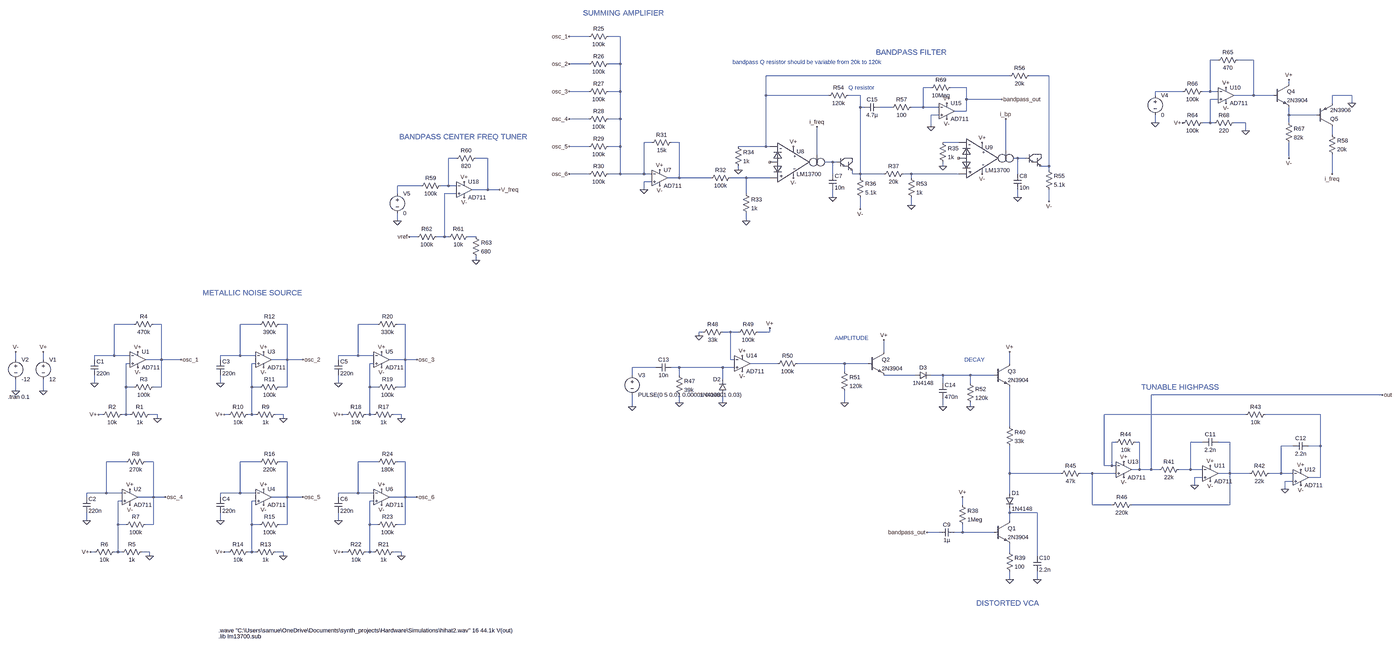
[diagram p0: schematic hihat.asc, whole sheet]
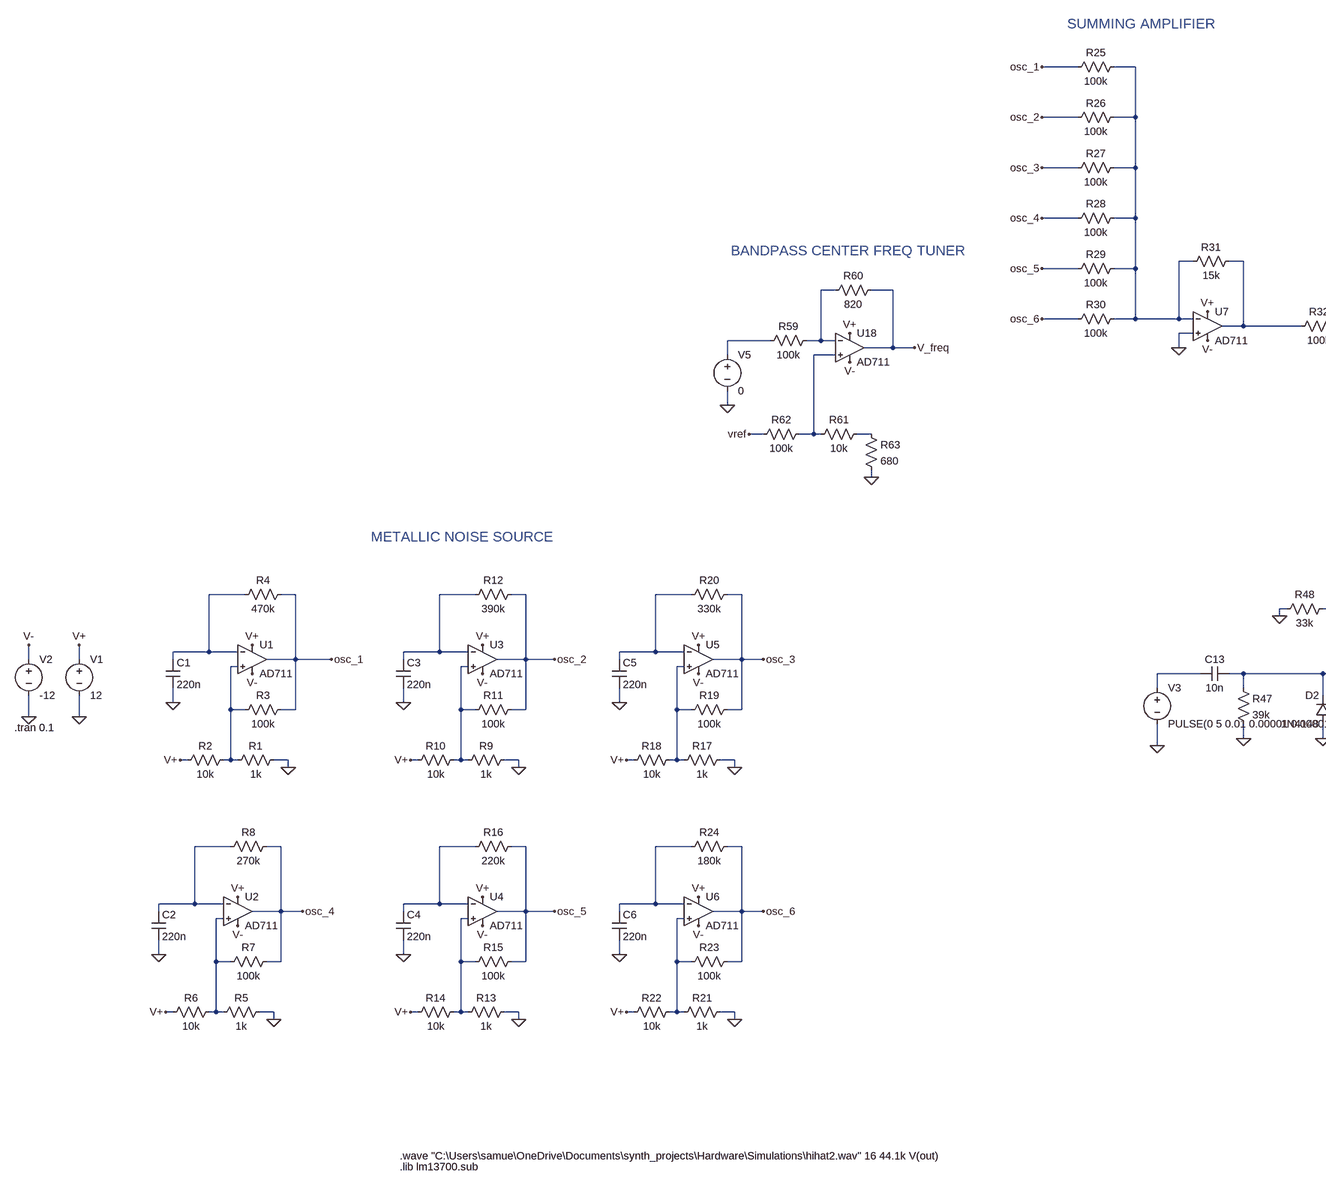
[diagram p1: schematic hihat.asc, part, row 1 of 1, column 1 of 2]
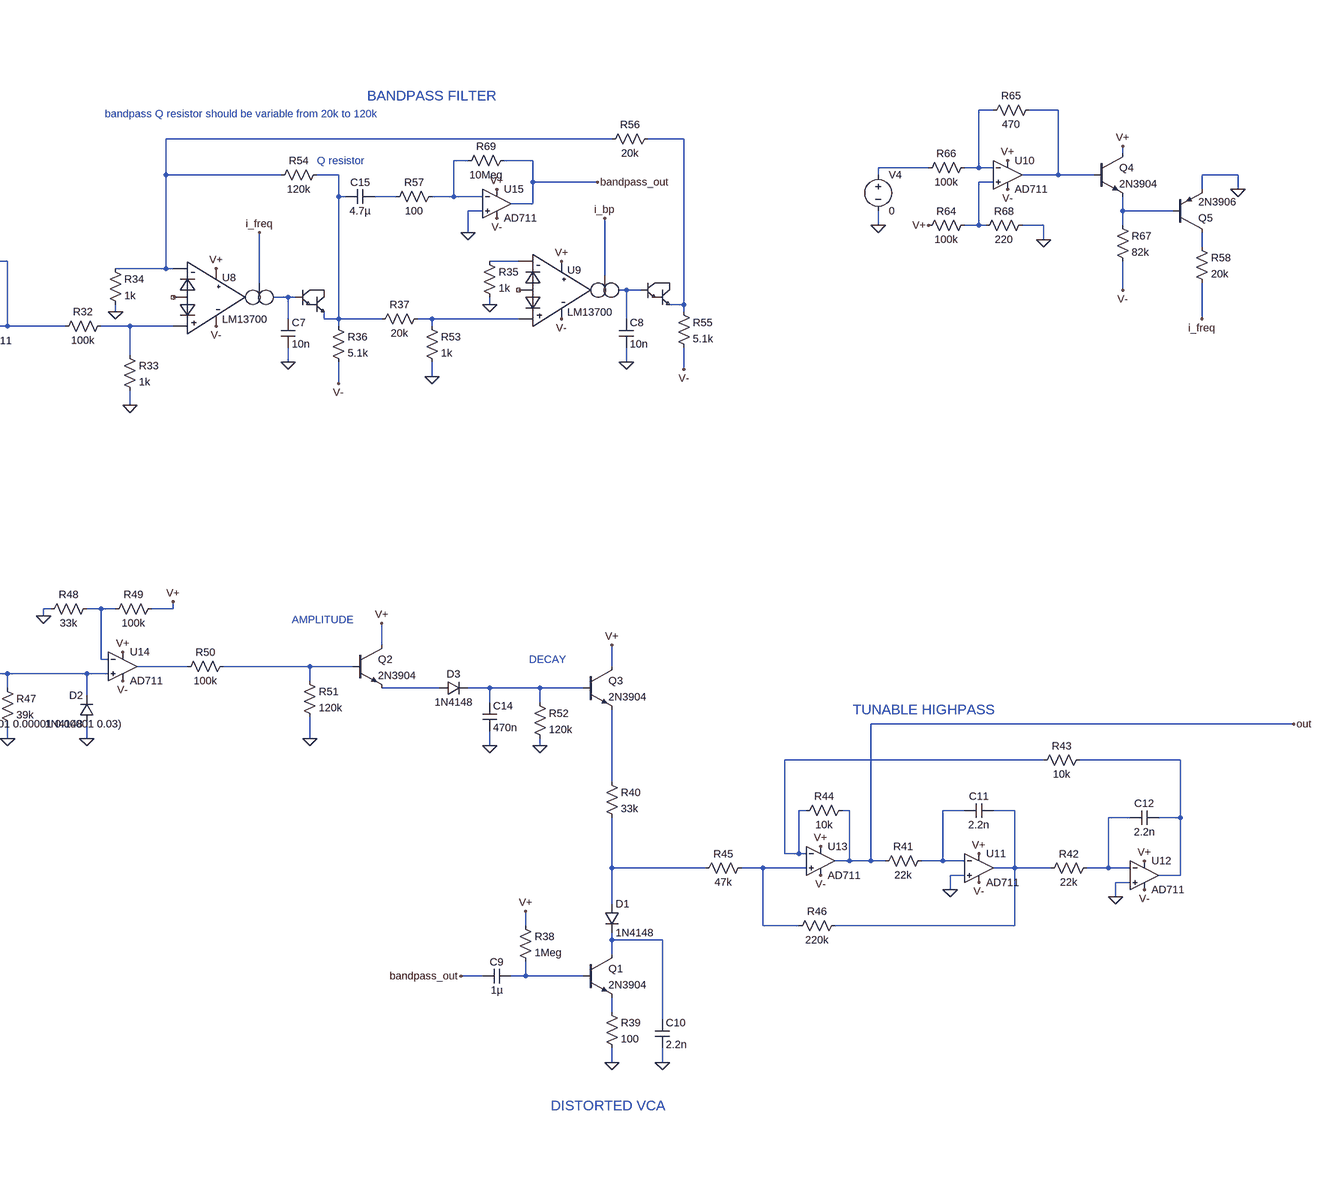
[diagram p2: schematic hihat.asc, part, row 1 of 1, column 2 of 2]
hihat.asc, the LTspice schematic file:
Version 4
SHEET 1 5096 2340
WIRE 1680 -1088 1600 -1088
WIRE 1808 -1088 1760 -1088
WIRE 4240 -992 4208 -992
WIRE 4384 -992 4320 -992
WIRE 1680 -976 1600 -976
WIRE 1808 -976 1808 -1088
WIRE 1808 -976 1760 -976
WIRE 3392 -928 2400 -928
WIRE 3552 -928 3472 -928
WIRE 4528 -896 4528 -912
WIRE 3072 -880 3040 -880
WIRE 3216 -880 3152 -880
WIRE 1680 -864 1600 -864
WIRE 1808 -864 1808 -976
WIRE 1808 -864 1760 -864
WIRE 4096 -864 3984 -864
WIRE 4208 -864 4208 -992
WIRE 4208 -864 4176 -864
WIRE 4240 -864 4208 -864
WIRE 2400 -848 2400 -928
WIRE 2656 -848 2400 -848
WIRE 2784 -848 2736 -848
WIRE 3984 -848 3984 -864
WIRE 4384 -848 4384 -992
WIRE 4384 -848 4304 -848
WIRE 4464 -848 4384 -848
WIRE 4784 -848 4704 -848
WIRE 3216 -832 3216 -880
WIRE 3360 -832 3216 -832
WIRE 4240 -832 4208 -832
WIRE 4704 -816 4704 -848
WIRE 4784 -816 4784 -848
WIRE 2784 -800 2784 -848
WIRE 2800 -800 2784 -800
WIRE 2912 -800 2864 -800
WIRE 3040 -800 3040 -880
WIRE 3040 -800 2992 -800
WIRE 3104 -800 3040 -800
WIRE 3216 -784 3216 -832
WIRE 3216 -784 3168 -784
WIRE 3104 -768 3072 -768
WIRE 4528 -768 4528 -800
WIRE 4640 -768 4528 -768
WIRE 1680 -752 1600 -752
WIRE 1808 -752 1808 -864
WIRE 1808 -752 1760 -752
WIRE 3984 -736 3984 -768
WIRE 4208 -736 4208 -832
WIRE 4208 -736 4176 -736
WIRE 4224 -736 4208 -736
WIRE 4352 -736 4304 -736
WIRE 4528 -736 4528 -768
WIRE 3072 -720 3072 -768
WIRE 4352 -704 4352 -736
WIRE 4704 -688 4704 -720
WIRE 1936 -656 1904 -656
WIRE 2048 -656 2016 -656
WIRE 3184 -656 3120 -656
WIRE 1680 -640 1600 -640
WIRE 1808 -640 1808 -752
WIRE 1808 -640 1760 -640
WIRE 2400 -640 2400 -848
WIRE 2400 -640 2288 -640
WIRE 2416 -640 2400 -640
WIRE 3376 -624 3376 -752
WIRE 2608 -608 2608 -720
WIRE 624 -592 592 -592
WIRE 752 -592 704 -592
WIRE 3424 -592 3408 -592
WIRE 3456 -592 3424 -592
WIRE 4528 -592 4528 -656
WIRE 2672 -576 2640 -576
WIRE 2688 -576 2672 -576
WIRE 3120 -560 3120 -576
WIRE 3552 -560 3552 -928
WIRE 3552 -560 3520 -560
WIRE 2288 -544 2288 -560
WIRE 3552 -544 3552 -560
WIRE 1680 -528 1600 -528
WIRE 1808 -528 1808 -640
WIRE 1808 -528 1760 -528
WIRE 1904 -528 1904 -656
WIRE 1904 -528 1808 -528
WIRE 1936 -528 1904 -528
WIRE 2672 -528 2672 -576
WIRE 2752 -528 2752 -544
WIRE 2784 -528 2784 -800
WIRE 2784 -528 2752 -528
WIRE 2880 -528 2784 -528
WIRE 2992 -528 2960 -528
WIRE 3184 -528 2992 -528
WIRE 3424 -528 3424 -592
WIRE 4704 -528 4704 -608
WIRE 2048 -512 2048 -656
WIRE 2048 -512 2000 -512
WIRE 2176 -512 2048 -512
WIRE 2320 -512 2256 -512
WIRE 2416 -512 2320 -512
WIRE 2784 -512 2784 -528
WIRE 2992 -512 2992 -528
WIRE 1936 -496 1904 -496
WIRE 480 -480 384 -480
WIRE 592 -480 592 -592
WIRE 592 -480 560 -480
WIRE 624 -480 592 -480
WIRE 752 -464 752 -592
WIRE 752 -464 688 -464
WIRE 800 -464 752 -464
WIRE 1904 -464 1904 -496
WIRE 384 -448 384 -480
WIRE 624 -448 576 -448
WIRE 2320 -448 2320 -512
WIRE 2672 -432 2672 -464
WIRE 3424 -432 3424 -464
WIRE 3552 -416 3552 -464
WIRE 2992 -400 2992 -432
WIRE 2784 -384 2784 -432
WIRE 384 -336 384 -368
WIRE 2320 -336 2320 -368
WIRE 464 -272 432 -272
WIRE 576 -272 576 -448
WIRE 576 -272 544 -272
WIRE 592 -272 576 -272
WIRE 704 -272 672 -272
WIRE 704 -176 704 -192
WIRE -688 256 -768 256
WIRE -576 256 -608 256
WIRE -176 256 -256 256
WIRE -64 256 -96 256
WIRE 304 256 224 256
WIRE 416 256 384 256
WIRE 2144 288 2128 288
WIRE 2256 288 2224 288
WIRE 2288 288 2256 288
WIRE 2416 288 2416 272
WIRE 2416 288 2368 288
WIRE 2128 304 2128 288
WIRE 2880 368 2880 320
WIRE -768 384 -768 256
WIRE -768 384 -848 384
WIRE -704 384 -768 384
WIRE -256 384 -256 256
WIRE -256 384 -336 384
WIRE -192 384 -256 384
WIRE 224 384 224 256
WIRE 224 384 144 384
WIRE 288 384 224 384
WIRE -1712 400 -1712 368
WIRE -1600 400 -1600 368
WIRE -848 400 -848 384
WIRE -576 400 -576 256
WIRE -576 400 -640 400
WIRE -496 400 -576 400
WIRE -336 400 -336 384
WIRE -64 400 -64 256
WIRE -64 400 -128 400
WIRE 0 400 -64 400
WIRE 144 400 144 384
WIRE 416 400 416 256
WIRE 416 400 352 400
WIRE 464 400 416 400
WIRE 2256 400 2256 288
WIRE 2272 400 2256 400
WIRE -704 416 -720 416
WIRE -192 416 -208 416
WIRE 288 416 272 416
WIRE 2448 416 2336 416
WIRE 2720 416 2528 416
WIRE 2816 416 2720 416
WIRE 3392 416 3392 368
WIRE 1952 432 1856 432
WIRE 2048 432 2016 432
WIRE 2224 432 2048 432
WIRE 2272 432 2224 432
WIRE 2720 448 2720 416
WIRE 1856 464 1856 432
WIRE 2048 464 2048 432
WIRE 3008 464 2880 464
WIRE 3120 464 3072 464
WIRE 3232 464 3120 464
WIRE 3328 464 3232 464
WIRE 2224 480 2224 432
WIRE -848 496 -848 464
WIRE -336 496 -336 464
WIRE 144 496 144 464
WIRE 3120 496 3120 464
WIRE 3232 496 3232 464
WIRE -720 512 -720 416
WIRE -688 512 -720 512
WIRE -576 512 -576 400
WIRE -576 512 -608 512
WIRE -208 512 -208 416
WIRE -176 512 -208 512
WIRE -64 512 -64 400
WIRE -64 512 -96 512
WIRE 272 512 272 416
WIRE 304 512 272 512
WIRE 416 512 416 400
WIRE 416 512 384 512
WIRE -1712 528 -1712 480
WIRE -1600 528 -1600 480
WIRE 5040 544 3968 544
WIRE 2048 576 2048 544
WIRE 2224 576 2224 544
WIRE 2720 576 2720 528
WIRE 1856 592 1856 544
WIRE 3120 592 3120 560
WIRE 3232 592 3232 576
WIRE -816 624 -832 624
WIRE -720 624 -720 512
WIRE -720 624 -736 624
WIRE -704 624 -720 624
WIRE -592 624 -624 624
WIRE -304 624 -320 624
WIRE -208 624 -208 512
WIRE -208 624 -224 624
WIRE -192 624 -208 624
WIRE -80 624 -112 624
WIRE 176 624 160 624
WIRE 272 624 272 512
WIRE 272 624 256 624
WIRE 288 624 272 624
WIRE 400 624 368 624
WIRE 4352 624 3776 624
WIRE 4656 624 4432 624
WIRE -592 640 -592 624
WIRE -80 640 -80 624
WIRE 400 640 400 624
WIRE 3392 672 3392 512
WIRE 3824 736 3808 736
WIRE 3920 736 3904 736
WIRE 4176 736 4128 736
WIRE 4288 736 4240 736
WIRE 4544 752 4496 752
WIRE 4656 752 4656 624
WIRE 4656 752 4608 752
WIRE -720 816 -800 816
WIRE -608 816 -640 816
WIRE -176 816 -256 816
WIRE -64 816 -96 816
WIRE 304 816 224 816
WIRE 416 816 384 816
WIRE 3776 832 3776 624
WIRE 3808 832 3808 736
WIRE 3808 832 3776 832
WIRE 3824 832 3808 832
WIRE 3920 848 3920 736
WIRE 3920 848 3888 848
WIRE 3968 848 3968 544
WIRE 3968 848 3920 848
WIRE 4000 848 3968 848
WIRE 4128 848 4128 736
WIRE 4128 848 4080 848
WIRE 4176 848 4128 848
WIRE 3392 864 3392 752
WIRE 3600 864 3392 864
WIRE 3728 864 3680 864
WIRE 3824 864 3728 864
WIRE 4288 864 4288 736
WIRE 4288 864 4240 864
WIRE 4368 864 4288 864
WIRE 4496 864 4496 752
WIRE 4496 864 4448 864
WIRE 4544 864 4496 864
WIRE 4176 880 4144 880
WIRE 4656 880 4656 752
WIRE 4656 880 4608 880
WIRE 4544 896 4512 896
WIRE 4144 912 4144 880
WIRE 4512 928 4512 896
WIRE -800 944 -800 816
WIRE -800 944 -880 944
WIRE -736 944 -800 944
WIRE -256 944 -256 816
WIRE -256 944 -336 944
WIRE -192 944 -256 944
WIRE 224 944 224 816
WIRE 224 944 144 944
WIRE 288 944 224 944
WIRE 3392 944 3392 864
WIRE -880 960 -880 944
WIRE -608 960 -608 816
WIRE -608 960 -672 960
WIRE -560 960 -608 960
WIRE -336 960 -336 944
WIRE -64 960 -64 816
WIRE -64 960 -128 960
WIRE 0 960 -64 960
WIRE 144 960 144 944
WIRE 416 960 416 816
WIRE 416 960 352 960
WIRE 464 960 416 960
WIRE -736 976 -752 976
WIRE -192 976 -208 976
WIRE 288 976 272 976
WIRE 3200 992 3200 960
WIRE 3728 992 3728 864
WIRE 3808 992 3728 992
WIRE 4288 992 4288 864
WIRE 4288 992 3888 992
WIRE 3392 1024 3392 1008
WIRE 3504 1024 3392 1024
WIRE -880 1056 -880 1024
WIRE -336 1056 -336 1024
WIRE 144 1056 144 1024
WIRE 3392 1056 3392 1024
WIRE -752 1072 -752 976
WIRE -720 1072 -752 1072
WIRE -608 1072 -608 960
WIRE -608 1072 -640 1072
WIRE -208 1072 -208 976
WIRE -176 1072 -208 1072
WIRE -64 1072 -64 960
WIRE -64 1072 -96 1072
WIRE 272 1072 272 976
WIRE 304 1072 272 1072
WIRE 416 1072 416 960
WIRE 416 1072 384 1072
WIRE 3104 1104 3056 1104
WIRE 3200 1104 3200 1072
WIRE 3200 1104 3168 1104
WIRE 3328 1104 3200 1104
WIRE -848 1184 -864 1184
WIRE -752 1184 -752 1072
WIRE -752 1184 -768 1184
WIRE -736 1184 -752 1184
WIRE -624 1184 -656 1184
WIRE -304 1184 -320 1184
WIRE -208 1184 -208 1072
WIRE -208 1184 -224 1184
WIRE -192 1184 -208 1184
WIRE -80 1184 -112 1184
WIRE 176 1184 160 1184
WIRE 272 1184 272 1072
WIRE 272 1184 256 1184
WIRE 288 1184 272 1184
WIRE 400 1184 368 1184
WIRE 3392 1184 3392 1152
WIRE -624 1200 -624 1184
WIRE -80 1200 -80 1184
WIRE 400 1200 400 1184
WIRE 3504 1200 3504 1024
WIRE 3392 1296 3392 1264
WIRE 3504 1296 3504 1264
FLAG -672 368 V+
FLAG -672 432 V-
FLAG -848 496 0
FLAG -592 640 0
FLAG -832 624 V+
FLAG -704 928 V+
FLAG -704 992 V-
FLAG -880 1056 0
FLAG -624 1200 0
FLAG -864 1184 V+
FLAG -160 368 V+
FLAG -160 432 V-
FLAG -336 496 0
FLAG -80 640 0
FLAG -320 624 V+
FLAG -160 928 V+
FLAG -160 992 V-
FLAG -336 1056 0
FLAG -80 1200 0
FLAG -320 1184 V+
FLAG 320 368 V+
FLAG 320 432 V-
FLAG 144 496 0
FLAG 400 640 0
FLAG 160 624 V+
FLAG 320 928 V+
FLAG 320 992 V-
FLAG 144 1056 0
FLAG 400 1200 0
FLAG 160 1184 V+
FLAG -496 400 osc_1
FLAG 0 400 osc_2
FLAG 464 400 osc_3
FLAG 464 960 osc_6
FLAG 0 960 osc_5
FLAG -560 960 osc_4
FLAG -1600 528 0
FLAG -1600 368 V+
FLAG -1712 528 0
FLAG -1712 368 V-
FLAG 1600 -1088 osc_1
FLAG 1600 -976 osc_2
FLAG 1600 -864 osc_3
FLAG 1600 -752 osc_4
FLAG 1600 -640 osc_5
FLAG 1600 -528 osc_6
FLAG 1968 -544 V+
FLAG 1968 -480 V-
FLAG 1904 -464 0
FLAG 3200 960 V+
FLAG 3392 1296 0
FLAG 3504 1296 0
FLAG 4208 832 V+
FLAG 4208 896 V-
FLAG 4144 912 0
FLAG 4576 848 V+
FLAG 4576 912 V-
FLAG 4512 928 0
FLAG 3856 880 V-
FLAG 3856 816 V+
FLAG 5040 544 out
FLAG 2048 576 0
FLAG 2224 576 0
FLAG 2304 384 V+
FLAG 2304 448 V-
FLAG 2128 304 0
FLAG 2416 272 V+
FLAG 2720 576 0
FLAG 2880 320 V+
FLAG 3120 592 0
FLAG 3232 592 0
FLAG 3392 368 V+
FLAG 1856 592 0
FLAG 656 -496 V+
FLAG 656 -432 V-
FLAG 384 -336 0
FLAG 800 -464 V_freq
FLAG 432 -272 vref
FLAG 704 -176 0
FLAG 2320 -336 0
FLAG 2288 -544 0
FLAG 2512 -640 V+
FLAG 2512 -512 V-
FLAG 2608 -720 i_freq
FLAG 3280 -656 V+
FLAG 3280 -528 V-
FLAG 3120 -560 0
FLAG 2672 -432 0
FLAG 2784 -384 V-
FLAG 2992 -400 0
FLAG 3424 -432 0
FLAG 3552 -416 V-
FLAG 3360 -832 bandpass_out
FLAG 3376 -752 i_bp
FLAG 3056 1104 bandpass_out
FLAG 4704 -528 i_freq
FLAG 4272 -880 V+
FLAG 3984 -736 0
FLAG 4352 -704 0
FLAG 4096 -736 V+
FLAG 4272 -816 V-
FLAG 4528 -592 V-
FLAG 4528 -912 V+
FLAG 4784 -816 0
FLAG 3136 -816 V+
FLAG 3136 -752 V-
FLAG 3072 -720 0
SYMBOL OpAmps\\AD711 -672 336 R0
SYMATTR InstName U1
SYMBOL res -608 608 R90
WINDOW 0 0 56 VBottom 2
WINDOW 3 32 56 VTop 2
SYMATTR InstName R1
SYMATTR Value 1k
SYMBOL res -720 608 R90
WINDOW 0 0 56 VBottom 2
WINDOW 3 32 56 VTop 2
SYMATTR InstName R2
SYMATTR Value 10k
SYMBOL res -592 496 R90
WINDOW 0 0 56 VBottom 2
WINDOW 3 32 56 VTop 2
SYMATTR InstName R3
SYMATTR Value 100k
SYMBOL res -592 240 R90
WINDOW 0 0 56 VBottom 2
WINDOW 3 32 56 VTop 2
SYMATTR InstName R4
SYMATTR Value 470k
SYMBOL cap -864 400 R0
SYMATTR InstName C1
SYMATTR Value 220n
SYMBOL OpAmps\\AD711 -704 896 R0
SYMATTR InstName U2
SYMBOL res -640 1168 R90
WINDOW 0 0 56 VBottom 2
WINDOW 3 32 56 VTop 2
SYMATTR InstName R5
SYMATTR Value 1k
SYMBOL res -752 1168 R90
WINDOW 0 0 56 VBottom 2
WINDOW 3 32 56 VTop 2
SYMATTR InstName R6
SYMATTR Value 10k
SYMBOL res -624 1056 R90
WINDOW 0 0 56 VBottom 2
WINDOW 3 32 56 VTop 2
SYMATTR InstName R7
SYMATTR Value 100k
SYMBOL res -624 800 R90
WINDOW 0 0 56 VBottom 2
WINDOW 3 32 56 VTop 2
SYMATTR InstName R8
SYMATTR Value 270k
SYMBOL cap -896 960 R0
SYMATTR InstName C2
SYMATTR Value 220n
SYMBOL OpAmps\\AD711 -160 336 R0
SYMATTR InstName U3
SYMBOL res -96 608 R90
WINDOW 0 0 56 VBottom 2
WINDOW 3 32 56 VTop 2
SYMATTR InstName R9
SYMATTR Value 1k
SYMBOL res -208 608 R90
WINDOW 0 0 56 VBottom 2
WINDOW 3 32 56 VTop 2
SYMATTR InstName R10
SYMATTR Value 10k
SYMBOL res -80 496 R90
WINDOW 0 0 56 VBottom 2
WINDOW 3 32 56 VTop 2
SYMATTR InstName R11
SYMATTR Value 100k
SYMBOL res -80 240 R90
WINDOW 0 0 56 VBottom 2
WINDOW 3 32 56 VTop 2
SYMATTR InstName R12
SYMATTR Value 390k
SYMBOL cap -352 400 R0
SYMATTR InstName C3
SYMATTR Value 220n
SYMBOL OpAmps\\AD711 -160 896 R0
SYMATTR InstName U4
SYMBOL res -96 1168 R90
WINDOW 0 0 56 VBottom 2
WINDOW 3 32 56 VTop 2
SYMATTR InstName R13
SYMATTR Value 1k
SYMBOL res -208 1168 R90
WINDOW 0 0 56 VBottom 2
WINDOW 3 32 56 VTop 2
SYMATTR InstName R14
SYMATTR Value 10k
SYMBOL res -80 1056 R90
WINDOW 0 0 56 VBottom 2
WINDOW 3 32 56 VTop 2
SYMATTR InstName R15
SYMATTR Value 100k
SYMBOL res -80 800 R90
WINDOW 0 0 56 VBottom 2
WINDOW 3 32 56 VTop 2
SYMATTR InstName R16
SYMATTR Value 220k
SYMBOL cap -352 960 R0
SYMATTR InstName C4
SYMATTR Value 220n
SYMBOL OpAmps\\AD711 320 336 R0
SYMATTR InstName U5
SYMBOL res 384 608 R90
WINDOW 0 0 56 VBottom 2
WINDOW 3 32 56 VTop 2
SYMATTR InstName R17
SYMATTR Value 1k
SYMBOL res 272 608 R90
WINDOW 0 0 56 VBottom 2
WINDOW 3 32 56 VTop 2
SYMATTR InstName R18
SYMATTR Value 10k
SYMBOL res 400 496 R90
WINDOW 0 0 56 VBottom 2
WINDOW 3 32 56 VTop 2
SYMATTR InstName R19
SYMATTR Value 100k
SYMBOL res 400 240 R90
WINDOW 0 0 56 VBottom 2
WINDOW 3 32 56 VTop 2
SYMATTR InstName R20
SYMATTR Value 330k
SYMBOL cap 128 400 R0
SYMATTR InstName C5
SYMATTR Value 220n
SYMBOL OpAmps\\AD711 320 896 R0
SYMATTR InstName U6
SYMBOL res 384 1168 R90
WINDOW 0 0 56 VBottom 2
WINDOW 3 32 56 VTop 2
SYMATTR InstName R21
SYMATTR Value 1k
SYMBOL res 272 1168 R90
WINDOW 0 0 56 VBottom 2
WINDOW 3 32 56 VTop 2
SYMATTR InstName R22
SYMATTR Value 10k
SYMBOL res 400 1056 R90
WINDOW 0 0 56 VBottom 2
WINDOW 3 32 56 VTop 2
SYMATTR InstName R23
SYMATTR Value 100k
SYMBOL res 400 800 R90
WINDOW 0 0 56 VBottom 2
WINDOW 3 32 56 VTop 2
SYMATTR InstName R24
SYMATTR Value 180k
SYMBOL cap 128 960 R0
SYMATTR InstName C6
SYMATTR Value 220n
SYMBOL voltage -1600 384 R0
WINDOW 123 0 0 Left 0
WINDOW 39 0 0 Left 0
SYMATTR InstName V1
SYMATTR Value 12
SYMBOL voltage -1712 384 R0
WINDOW 123 0 0 Left 0
WINDOW 39 0 0 Left 0
SYMATTR InstName V2
SYMATTR Value -12
SYMBOL res 1776 -1104 R90
WINDOW 0 0 56 VBottom 2
WINDOW 3 32 56 VTop 2
SYMATTR InstName R25
SYMATTR Value 100k
SYMBOL res 1776 -992 R90
WINDOW 0 0 56 VBottom 2
WINDOW 3 32 56 VTop 2
SYMATTR InstName R26
SYMATTR Value 100k
SYMBOL res 1776 -880 R90
WINDOW 0 0 56 VBottom 2
WINDOW 3 32 56 VTop 2
SYMATTR InstName R27
SYMATTR Value 100k
SYMBOL res 1776 -768 R90
WINDOW 0 0 56 VBottom 2
WINDOW 3 32 56 VTop 2
SYMATTR InstName R28
SYMATTR Value 100k
SYMBOL res 1776 -656 R90
WINDOW 0 0 56 VBottom 2
WINDOW 3 32 56 VTop 2
SYMATTR InstName R29
SYMATTR Value 100k
SYMBOL res 1776 -544 R90
WINDOW 0 0 56 VBottom 2
WINDOW 3 32 56 VTop 2
SYMATTR InstName R30
SYMATTR Value 100k
SYMBOL OpAmps\\AD711 1968 -576 R0
SYMATTR InstName U7
SYMBOL res 2032 -672 R90
WINDOW 0 0 56 VBottom 2
WINDOW 3 32 56 VTop 2
SYMATTR InstName R31
SYMATTR Value 15k
SYMBOL cap 3168 1088 R90
WINDOW 0 0 32 VBottom 2
WINDOW 3 32 32 VTop 2
SYMATTR InstName C9
SYMATTR Value 1µ
SYMBOL res 3184 976 R0
SYMATTR InstName R38
SYMATTR Value 1Meg
SYMBOL npn 3328 1056 R0
SYMATTR InstName Q1
SYMATTR Value 2N3904
SYMBOL res 3376 1168 R0
SYMATTR InstName R39
SYMATTR Value 100
SYMBOL diode 3376 944 R0
SYMATTR InstName D1
SYMATTR Value 1N4148
SYMBOL cap 3488 1200 R0
SYMATTR InstName C10
SYMATTR Value 2.2n
SYMBOL res 3376 656 R0
SYMATTR InstName R40
SYMATTR Value 33k
SYMBOL OpAmps\\AD711 4208 800 R0
SYMATTR InstName U11
SYMBOL res 4096 832 R90
WINDOW 0 0 56 VBottom 2
WINDOW 3 32 56 VTop 2
SYMATTR InstName R41
SYMATTR Value 22k
SYMBOL cap 4240 720 R90
WINDOW 0 0 32 VBottom 2
WINDOW 3 32 32 VTop 2
SYMATTR InstName C11
SYMATTR Value 2.2n
SYMBOL OpAmps\\AD711 4576 816 R0
SYMATTR InstName U12
SYMBOL res 4464 848 R90
WINDOW 0 0 56 VBottom 2
WINDOW 3 32 56 VTop 2
SYMATTR InstName R42
SYMATTR Value 22k
SYMBOL cap 4608 736 R90
WINDOW 0 0 32 VBottom 2
WINDOW 3 32 32 VTop 2
SYMATTR InstName C12
SYMATTR Value 2.2n
SYMBOL OpAmps\\AD711 3856 784 R0
SYMATTR InstName U13
SYMBOL res 4448 608 R90
WINDOW 0 0 56 VBottom 2
WINDOW 3 32 56 VTop 2
SYMATTR InstName R43
SYMATTR Value 10k
SYMBOL res 3920 720 R90
WINDOW 0 0 56 VBottom 2
WINDOW 3 32 56 VTop 2
SYMATTR InstName R44
SYMATTR Value 10k
SYMBOL res 3696 848 R90
WINDOW 0 0 56 VBottom 2
WINDOW 3 32 56 VTop 2
SYMATTR InstName R45
SYMATTR Value 47k
SYMBOL res 3904 976 R90
WINDOW 0 0 56 VBottom 2
WINDOW 3 32 56 VTop 2
SYMATTR InstName R46
SYMATTR Value 220k
SYMBOL cap 2016 416 R90
WINDOW 0 0 32 VBottom 2
WINDOW 3 32 32 VTop 2
SYMATTR InstName C13
SYMATTR Value 10n
SYMBOL res 2032 448 R0
SYMATTR InstName R47
SYMATTR Value 39k
SYMBOL diode 2240 544 R180
WINDOW 0 24 64 Left 2
WINDOW 3 24 0 Left 2
SYMATTR InstName D2
SYMATTR Value 1N4148
SYMBOL OpAmps\\AD711 2304 352 R0
SYMATTR InstName U14
SYMBOL res 2240 272 R90
WINDOW 0 0 56 VBottom 2
WINDOW 3 32 56 VTop 2
SYMATTR InstName R48
SYMATTR Value 33k
SYMBOL res 2384 272 R90
WINDOW 0 0 56 VBottom 2
WINDOW 3 32 56 VTop 2
SYMATTR InstName R49
SYMATTR Value 100k
SYMBOL res 2544 400 R90
WINDOW 0 0 56 VBottom 2
WINDOW 3 32 56 VTop 2
SYMATTR InstName R50
SYMATTR Value 100k
SYMBOL res 2704 432 R0
SYMATTR InstName R51
SYMATTR Value 120k
SYMBOL npn 2816 368 R0
SYMATTR InstName Q2
SYMATTR Value 2N3904
SYMBOL diode 3008 480 R270
WINDOW 0 32 32 VTop 2
WINDOW 3 0 32 VBottom 2
SYMATTR InstName D3
SYMATTR Value 1N4148
SYMBOL cap 3104 496 R0
SYMATTR InstName C14
SYMATTR Value 470n
SYMBOL res 3216 480 R0
SYMATTR InstName R52
SYMATTR Value 120k
SYMBOL npn 3328 416 R0
SYMATTR InstName Q3
SYMATTR Value 2N3904
SYMBOL voltage 1856 448 R0
WINDOW 123 0 0 Left 0
WINDOW 39 0 0 Left 0
SYMATTR InstName V3
SYMATTR Value PULSE(0 5 0.01 0.00001 0.00001 0.03)
SYMBOL OpAmps\\AD711 656 -528 R0
SYMATTR InstName U18
SYMBOL res 576 -496 R90
WINDOW 0 0 56 VBottom 2
WINDOW 3 32 56 VTop 2
SYMATTR InstName R59
SYMATTR Value 100k
SYMBOL res 720 -608 R90
WINDOW 0 0 56 VBottom 2
WINDOW 3 32 56 VTop 2
SYMATTR InstName R60
SYMATTR Value 820
SYMBOL voltage 384 -464 R0
WINDOW 123 0 0 Left 0
WINDOW 39 0 0 Left 0
SYMATTR InstName V5
SYMATTR Value 0
SYMBOL res 576 -256 R270
WINDOW 0 32 56 VTop 2
WINDOW 3 0 56 VBottom 2
SYMATTR InstName R61
SYMATTR Value 10k
SYMBOL res 448 -256 R270
WINDOW 0 32 56 VTop 2
WINDOW 3 0 56 VBottom 2
SYMATTR InstName R62
SYMATTR Value 100k
SYMBOL res 688 -288 R0
SYMATTR InstName R63
SYMATTR Value 680
SYMBOL res 2272 -528 R90
WINDOW 0 0 56 VBottom 2
WINDOW 3 32 56 VTop 2
SYMATTR InstName R32
SYMATTR Value 100k
SYMBOL res 2304 -464 R0
SYMATTR InstName R33
SYMATTR Value 1k
SYMBOL res 2272 -656 R0
SYMATTR InstName R34
SYMATTR Value 1k
SYMBOL res 3104 -672 R0
SYMATTR InstName R35
SYMATTR Value 1k
SYMBOL cap 2656 -528 R0
SYMATTR InstName C7
SYMATTR Value 10n
SYMBOL res 2768 -528 R0
SYMATTR InstName R36
SYMATTR Value 5.1k
SYMBOL res 2976 -544 R90
WINDOW 0 0 56 VBottom 2
WINDOW 3 32 56 VTop 2
SYMATTR InstName R37
SYMATTR Value 20k
SYMBOL res 2976 -528 R0
SYMATTR InstName R53
SYMATTR Value 1k
SYMBOL res 2752 -864 R90
WINDOW 0 0 56 VBottom 2
WINDOW 3 32 56 VTop 2
SYMATTR InstName R54
SYMATTR Value 120k
SYMBOL cap 3408 -528 R0
SYMATTR InstName C8
SYMATTR Value 10n
SYMBOL res 3536 -560 R0
SYMATTR InstName R55
SYMATTR Value 5.1k
SYMBOL res 3488 -944 R90
WINDOW 0 0 56 VBottom 2
WINDOW 3 32 56 VTop 2
SYMATTR InstName R56
SYMATTR Value 20k
SYMBOL LM13700 2480 -656 R0
SYMATTR InstName U8
SYMBOL LM13700 3248 -672 R0
SYMATTR InstName U9
SYMBOL res 4688 -704 R0
SYMATTR InstName R58
SYMATTR Value 20k
SYMBOL OpAmps\\AD711 4272 -912 R0
SYMATTR InstName U10
SYMBOL res 4192 -752 R90
WINDOW 0 0 56 VBottom 2
WINDOW 3 32 56 VTop 2
SYMATTR InstName R64
SYMATTR Value 100k
SYMBOL res 4336 -1008 R90
WINDOW 0 0 56 VBottom 2
WINDOW 3 32 56 VTop 2
SYMATTR InstName R65
SYMATTR Value 470
SYMBOL res 4192 -880 R90
WINDOW 0 0 56 VBottom 2
WINDOW 3 32 56 VTop 2
SYMATTR InstName R66
SYMATTR Value 100k
SYMBOL npn 4464 -896 R0
SYMATTR InstName Q4
SYMATTR Value 2N3904
SYMBOL res 4512 -752 R0
SYMATTR InstName R67
SYMATTR Value 82k
SYMBOL pnp 4640 -720 M180
SYMATTR InstName Q5
SYMATTR Value 2N3906
SYMBOL voltage 3984 -864 R0
WINDOW 123 0 0 Left 0
WINDOW 39 0 0 Left 0
SYMATTR InstName V4
SYMATTR Value 0
SYMBOL res 4320 -752 R90
WINDOW 0 0 56 VBottom 2
WINDOW 3 32 56 VTop 2
SYMATTR InstName R68
SYMATTR Value 220
SYMBOL OpAmps\\AD711 3136 -848 R0
SYMATTR InstName U15
SYMBOL cap 2864 -816 R90
WINDOW 0 0 32 VBottom 2
WINDOW 3 32 32 VTop 2
SYMATTR InstName C15
SYMATTR Value 4.7µ
SYMBOL res 3008 -816 R90
WINDOW 0 0 56 VBottom 2
WINDOW 3 32 56 VTop 2
SYMATTR InstName R57
SYMATTR Value 100
SYMBOL res 3168 -896 R90
WINDOW 0 0 56 VBottom 2
WINDOW 3 32 56 VTop 2
SYMATTR InstName R69
SYMATTR Value 10Meg
TEXT -1744 552 Left 2 !.tran 0.1
TEXT -408 128 Left 3 ;METALLIC NOISE SOURCE
TEXT 1656 -1184 Left 3 ;SUMMING AMPLIFIER
TEXT 3256 1392 Left 3 ;DISTORTED VCA
TEXT 3928 512 Left 3 ;TUNABLE HIGHPASS
TEXT -344 1504 Left 2 !.wave "C:\\Users\\samue\\OneDrive\\Documents\\synth_projects\\Hardware\\Simulations\\hihat2.wav" 16 44.1k V(out)
TEXT 392 -680 Left 3 ;BANDPASS CENTER FREQ TUNER
TEXT 2848 -1024 Left 3 ;BANDPASS FILTER
TEXT -344 1528 Left 2 !.lib lm13700.sub
TEXT 2264 -984 Left 2 ;bandpass Q resistor should be variable from 20k to 120k
TEXT 2736 -880 Left 2 ;Q resistor
TEXT 3208 400 Left 2 ;DECAY
TEXT 2680 312 Left 2 ;AMPLITUDE

The netlist it stands for:
* hihat.asc
XU1 N027 N023 V+ V- osc_1 AD712  ; AD711, pins In+ In- V+ V- OUT
R1 0 N027 1k
R2 N027 V+ 10k
R3 osc_1 N027 100k
R4 osc_1 N023 470k
C1 N023 0 220n
XU2 N047 N042 V+ V- osc_4 AD712  ; AD711, pins In+ In- V+ V- OUT
R5 0 N047 1k
R6 N047 V+ 10k
R7 osc_4 N047 100k
R8 osc_4 N042 270k
C2 N042 0 220n
XU3 N028 N024 V+ V- osc_2 AD712  ; AD711, pins In+ In- V+ V- OUT
R9 0 N028 1k
R10 N028 V+ 10k
R11 osc_2 N028 100k
R12 osc_2 N024 390k
C3 N024 0 220n
XU4 N048 N043 V+ V- osc_5 AD712  ; AD711, pins In+ In- V+ V- OUT
R13 0 N048 1k
R14 N048 V+ 10k
R15 osc_5 N048 100k
R16 osc_5 N043 220k
C4 N043 0 220n
XU5 N029 N025 V+ V- osc_3 AD712  ; AD711, pins In+ In- V+ V- OUT
R17 0 N029 1k
R18 N029 V+ 10k
R19 osc_3 N029 100k
R20 osc_3 N025 330k
C5 N025 0 220n
XU6 N049 N044 V+ V- osc_6 AD712  ; AD711, pins In+ In- V+ V- OUT
R21 0 N049 1k
R22 N049 V+ 10k
R23 osc_6 N049 100k
R24 osc_6 N044 180k
C6 N044 0 220n
V1 V+ 0 12
V2 V- 0 -12
R25 N001 osc_1 100k
R26 N001 osc_2 100k
R27 N001 osc_3 100k
R28 N001 osc_4 100k
R29 N001 osc_5 100k
R30 N001 osc_6 100k
XU7 0 N001 V+ V- N013 AD712  ; AD711, pins In+ In- V+ V- OUT
R31 N013 N001 15k
C9 N051 bandpass_out 1µ
R38 V+ N051 1Meg
Q1 N050 N051 N052 0 2N3904
R39 N052 0 100
D1 N045 N050 1N4148
C10 N050 0 2.2n
R40 N038 N045 33k
XU11 0 N039 V+ V- N040 AD712  ; AD711, pins In+ In- V+ V- OUT
R41 N039 out 22k
C11 N040 N039 2.2n
XU12 0 N041 V+ V- N037 AD712  ; AD711, pins In+ In- V+ V- OUT
R42 N041 N040 22k
C12 N037 N041 2.2n
XU13 N046 N036 V+ V- out AD712  ; AD711, pins In+ In- V+ V- OUT
R43 N037 N036 10k
R44 out N036 10k
R45 N046 N045 47k
R46 N040 N046 220k
C13 N033 N032 10n
R47 N033 0 39k
D2 0 N033 1N4148
XU14 N033 N026 V+ V- N030 AD712  ; AD711, pins In+ In- V+ V- OUT
R48 N026 0 33k
R49 V+ N026 100k
R50 N031 N030 100k
R51 N031 0 120k
Q2 V+ N031 N034 0 2N3904
D3 N034 N035 1N4148
C14 N035 0 470n
R52 N035 0 120k
Q3 V+ N035 N038 0 2N3904
V3 N032 0 PULSE(0 5 0.01 0.00001 0.00001 0.03)
XU18 N021 N015 V+ V- V_freq AD712  ; AD711, pins In+ In- V+ V- OUT
R59 N015 N020 100k
R60 V_freq N015 820
V5 N020 0 0
R61 N021 N022 10k
R62 vref N021 100k
R63 N022 0 680
R32 N019 N013 100k
R33 N019 0 1k
R34 N004 0 1k
R35 N014 0 1k
C7 N017 0 10n
R36 N008 V- 5.1k
R37 N018 N008 20k
R53 N018 0 1k
R54 N008 N004 120k
C8 N016 0 10n
R55 N005 V- 5.1k
R56 N005 N004 20k
XU8 NC_01 N019 N004 i_freq N017 V+ V- N017 N008 LM13700 HALF13700  ; pins LIN INP INN IAB ? VCC VSS BIN BUF
XU9 NC_02 N018 N014 i_bp N016 V+ V- N016 N005 LM13700 HALF13700  ; pins LIN INP INN IAB ? VCC VSS BIN BUF
R58 N012 i_freq 20k
XU10 N009 N002 V+ V- N003 AD712  ; AD711, pins In+ In- V+ V- OUT
R64 N009 V+ 100k
R65 N003 N002 470
R66 N002 N007 100k
Q4 V+ N003 N011 0 2N3904
R67 N011 V- 82k
Q5 N012 N011 0 0 2N3906
V4 N007 0 0
R68 0 N009 220
XU15 0 N006 V+ V- bandpass_out AD712  ; AD711, pins In+ In- V+ V- OUT
C15 N010 N008 4.7µ
R57 N006 N010 100
R69 bandpass_out N006 10Meg
.model D D
.lib standard.dio
.model NPN NPN
.model PNP PNP
.lib standard.bjt
.tran 0.1
* METALLIC NOISE SOURCE
* SUMMING AMPLIFIER
* DISTORTED VCA
* TUNABLE HIGHPASS
.wave "C:\Users\samue\OneDrive\Documents\synth_projects\Hardware\Simulations\hihat2.wav" 16 44.1k V(out)
* BANDPASS CENTER FREQ TUNER
* BANDPASS FILTER
.lib lm13700.sub
* bandpass Q resistor should be variable from 20k to 120k
* Q resistor
* DECAY
* AMPLITUDE
.lib ADI1.lib
.backanno
.end